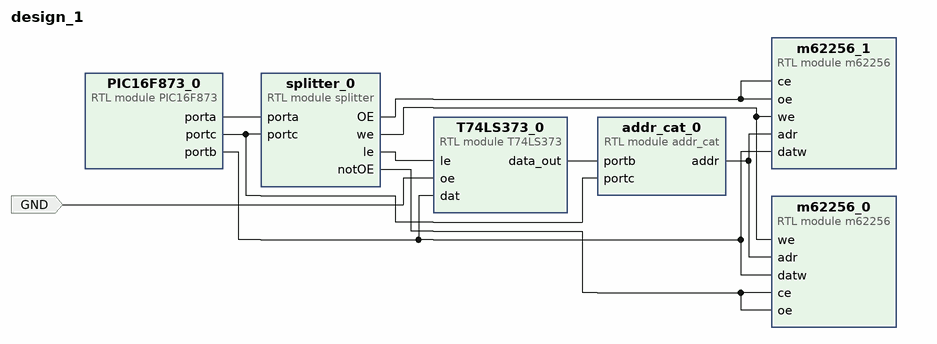
[diagram p0: block diagram of the top level]
# Vivado block design design_1, xc7z020clg484-1, Vivado 2019.2.1
create_bd_design design_1

create_bd_port -dir I GND

create_bd_cell -type module -reference PIC16F873 PIC16F873_0
create_bd_cell -type module -reference T74LS373 T74LS373_0
create_bd_cell -type module -reference addr_cat addr_cat_0
create_bd_cell -type module -reference m62256 m62256_0
create_bd_cell -type module -reference m62256 m62256_1
create_bd_cell -type module -reference splitter splitter_0

# ---- connections ----

connect_bd_net [get_bd_pins PIC16F873_0/porta] [get_bd_pins splitter_0/porta]
connect_bd_net [get_bd_pins splitter_0/le] [get_bd_pins T74LS373_0/le]
connect_bd_net [get_bd_pins splitter_0/we] [get_bd_pins m62256_0/we] [get_bd_pins m62256_1/we]
connect_bd_net [get_bd_pins PIC16F873_0/portc] [get_bd_pins addr_cat_0/portc] [get_bd_pins splitter_0/portc]
connect_bd_net [get_bd_pins splitter_0/notOE] [get_bd_pins m62256_0/ce] [get_bd_pins m62256_0/oe]
connect_bd_net [get_bd_pins splitter_0/OE] [get_bd_pins m62256_1/ce] [get_bd_pins m62256_1/oe]
connect_bd_net [get_bd_pins addr_cat_0/addr] [get_bd_pins m62256_0/adr] [get_bd_pins m62256_1/adr]
connect_bd_net [get_bd_pins PIC16F873_0/portb] [get_bd_pins m62256_0/datw] [get_bd_pins m62256_1/datw] [get_bd_pins T74LS373_0/dat]
connect_bd_net -net T74LS373_0_out [get_bd_pins T74LS373_0/data_out] [get_bd_pins addr_cat_0/portb]
connect_bd_net -net oe_0_1 [get_bd_ports GND] [get_bd_pins T74LS373_0/oe]

validate_bd_design
save_bd_design
